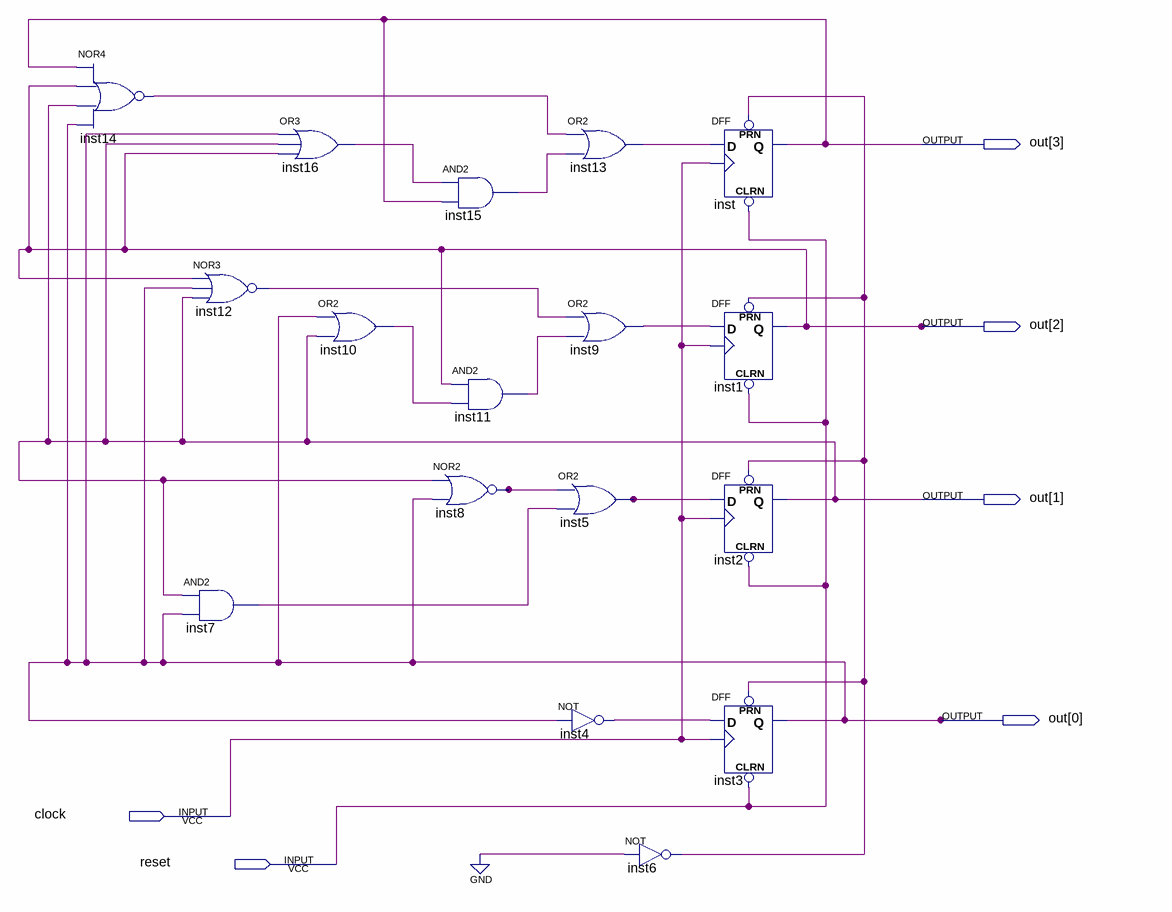
[diagram p0: schematic sheet]
// Quartus schematic counter4.bdf as structural Verilog: 17 symbols, 6 pins
module counter4 (
  input  clock,
  input  reset,
  output [3:0] out
);

  wire inst4_out, inst5_out, inst6_out, inst7_out, inst8_out, inst9_out, inst10_out, inst11_out, inst12_out,
       inst13_out, inst14_out, inst15_out, inst16_out;

  nor inst14 (inst14_out, out[3], out[2], out[1], out[0]);
  nor inst12 (inst12_out, out[2], out[0], out[1]);
  and inst7 (inst7_out, out[1], out[0]);
  or inst16 (inst16_out, out[0], out[1], out[2]);
  or inst10 (inst10_out, out[0], out[1]);
  and inst15 (inst15_out, inst16_out, out[3]);
  and inst11 (inst11_out, out[2], inst10_out);
  nor inst8 (inst8_out, out[1], out[0]);
  or inst13 (inst13_out, inst14_out, inst15_out);
  or inst9 (inst9_out, inst12_out, inst11_out);
  or inst5 (inst5_out, inst8_out, inst7_out);
  not inst4 (inst4_out, out[0]);
  not inst6 (inst6_out, 1'b0);
  DFF inst (.CLRN(reset), .CLK(clock), .D(inst13_out), .PRN(inst6_out), .Q(out[3]));
  DFF inst1 (.CLRN(reset), .CLK(clock), .D(inst9_out), .PRN(inst6_out), .Q(out[2]));
  DFF inst2 (.CLRN(reset), .CLK(clock), .D(inst5_out), .PRN(inst6_out), .Q(out[1]));
  DFF inst3 (.CLRN(reset), .CLK(clock), .D(inst4_out), .PRN(inst6_out), .Q(out[0]));
endmodule
